# EAGLE design Mux_Board-v0-1-0 (EAGLE 5.06)
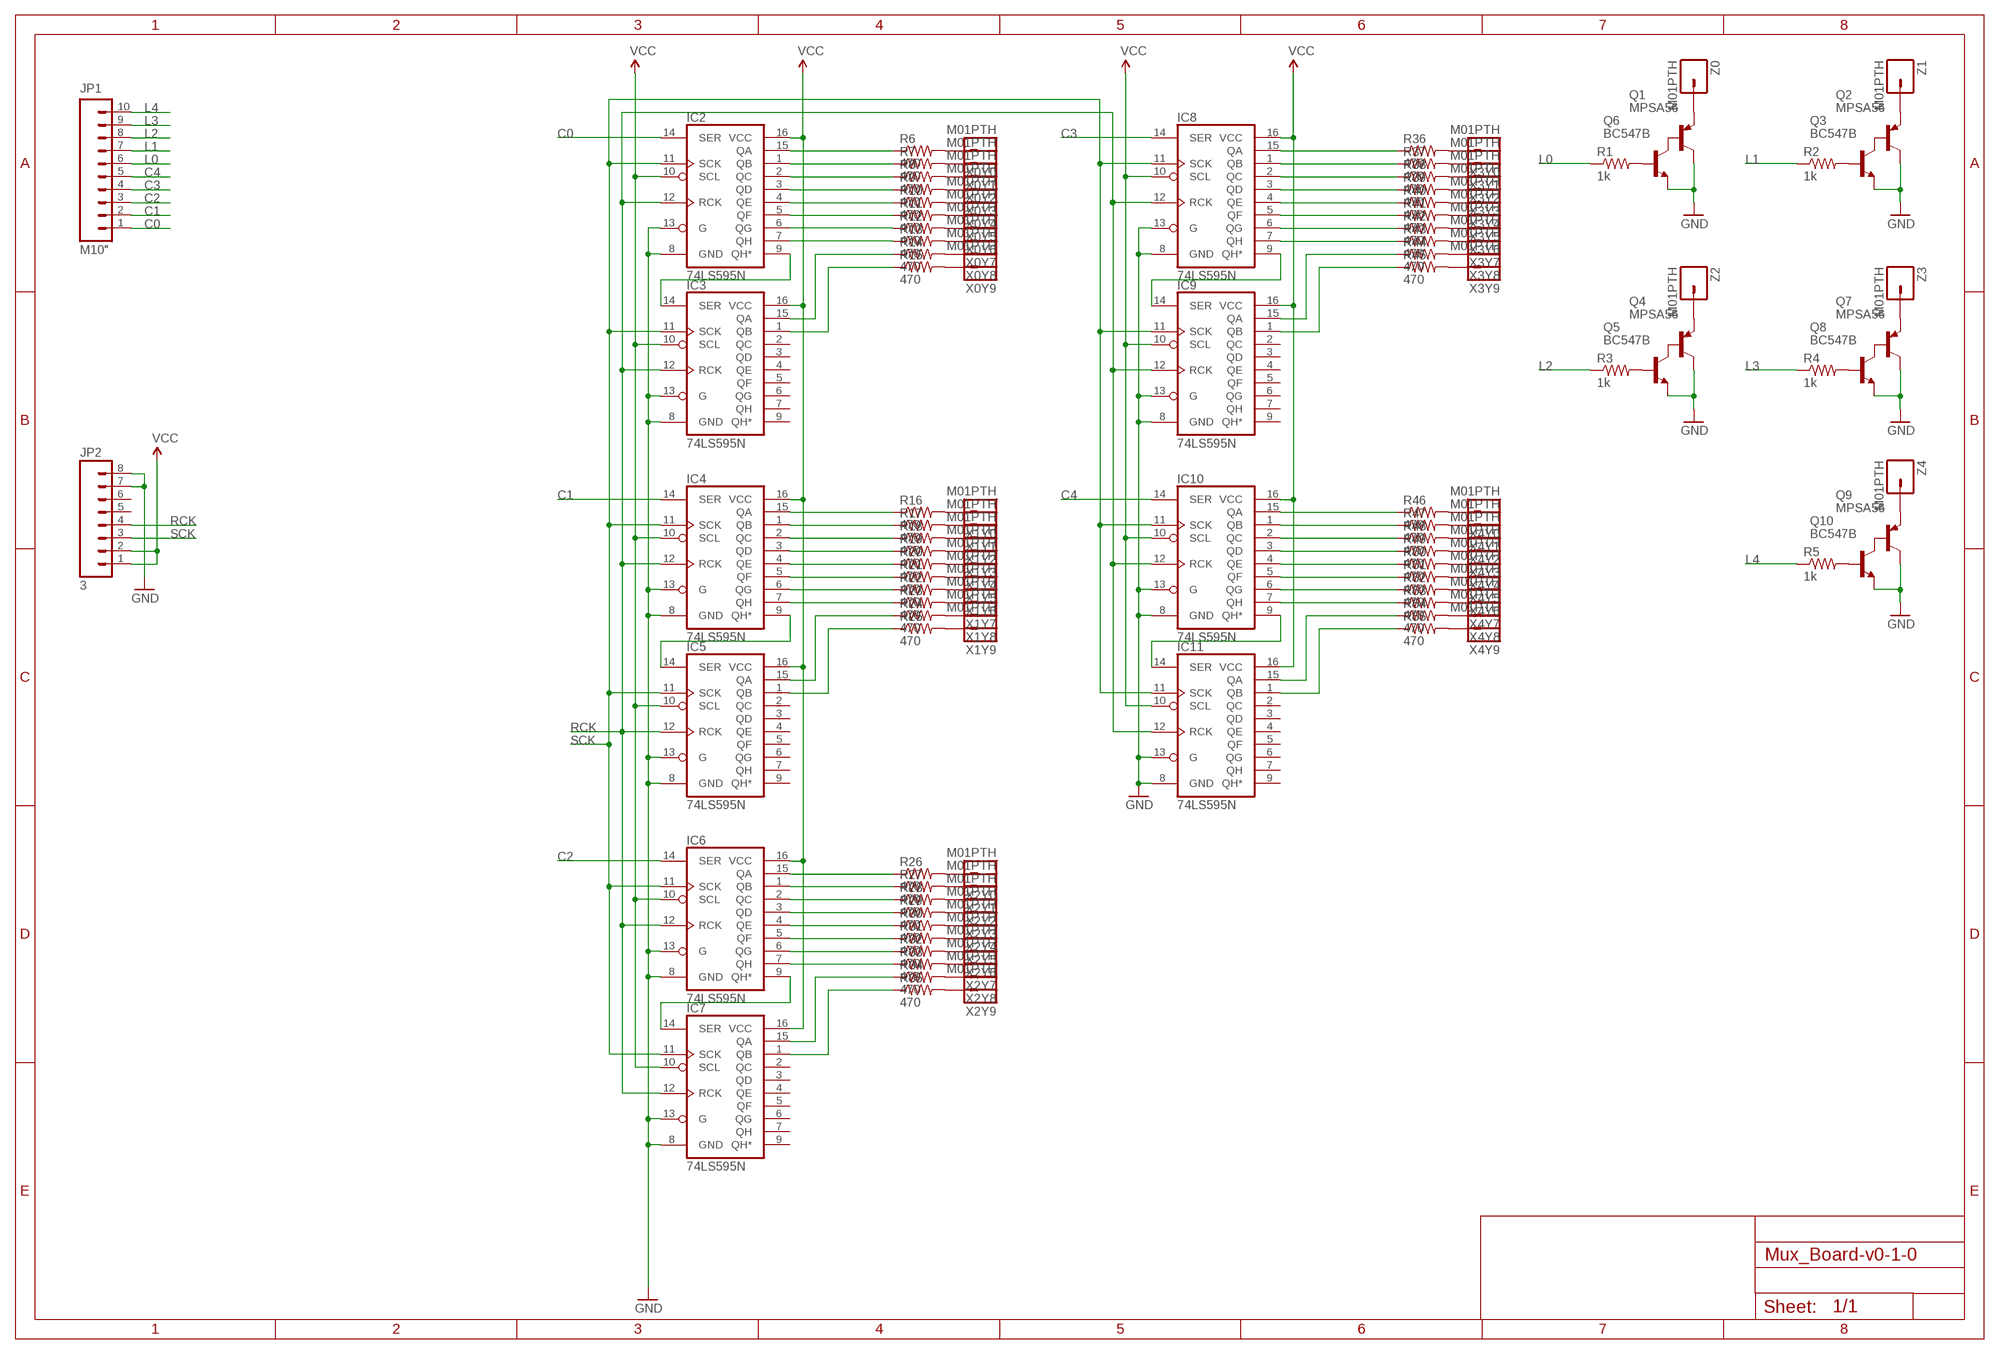
[diagram p0: schematic, sheet 1]

## Parts
IC2  74LS595N  [DIL16]
IC3  74LS595N  [DIL16]
IC4  74LS595N  [DIL16]
IC5  74LS595N  [DIL16]
IC6  74LS595N  [DIL16]
IC7  74LS595N  [DIL16]
IC8  74LS595N  [DIL16]
IC9  74LS595N  [DIL16]
IC10  74LS595N  [DIL16]
IC11  74LS595N  [DIL16]
JP1  M10"  [1X10]
JP2  3  M08  [1X08]
Q1  MPSA56  [TO92-CBE]
Q2  MPSA56  [TO92-CBE]
Q3  BC547B  [TO92]
Q4  MPSA56  [TO92-CBE]
Q5  BC547B  [TO92]
Q6  BC547B  [TO92]
Q7  MPSA56  [TO92-CBE]
Q8  BC547B  [TO92]
Q9  MPSA56  [TO92-CBE]
Q10  BC547B  [TO92]
R1  1k  RESISTORPTH-1/4W  [AXIAL-0.4]
R2  1k  RESISTORPTH-1/4W  [AXIAL-0.4]
R3  1k  RESISTORPTH-1/4W  [AXIAL-0.4]
R4  1k  RESISTORPTH-1/4W  [AXIAL-0.4]
R5  1k  RESISTORPTH-1/4W  [AXIAL-0.4]
R6  470  RESISTORPTH-1/4W  [AXIAL-0.4]
R7  470  RESISTORPTH-1/4W  [AXIAL-0.4]
R8  470  RESISTORPTH-1/4W  [AXIAL-0.4]
R9  470  RESISTORPTH-1/4W  [AXIAL-0.4]
R10  470  RESISTORPTH-1/4W  [AXIAL-0.4]
R11  470  RESISTORPTH-1/4W  [AXIAL-0.4]
R12  470  RESISTORPTH-1/4W  [AXIAL-0.4]
R13  470  RESISTORPTH-1/4W  [AXIAL-0.4]
R14  470  RESISTORPTH-1/4W  [AXIAL-0.4]
R15  470  RESISTORPTH-1/4W  [AXIAL-0.4]
R16  470  RESISTORPTH-1/4W  [AXIAL-0.4]
R17  470  RESISTORPTH-1/4W  [AXIAL-0.4]
R18  470  RESISTORPTH-1/4W  [AXIAL-0.4]
R19  470  RESISTORPTH-1/4W  [AXIAL-0.4]
R20  470  RESISTORPTH-1/4W  [AXIAL-0.4]
R21  470  RESISTORPTH-1/4W  [AXIAL-0.4]
R22  470  RESISTORPTH-1/4W  [AXIAL-0.4]
R23  470  RESISTORPTH-1/4W  [AXIAL-0.4]
R24  470  RESISTORPTH-1/4W  [AXIAL-0.4]
R25  470  RESISTORPTH-1/4W  [AXIAL-0.4]
R26  470  RESISTORPTH-1/4W  [AXIAL-0.4]
R27  470  RESISTORPTH-1/4W  [AXIAL-0.4]
R28  470  RESISTORPTH-1/4W  [AXIAL-0.4]
R29  470  RESISTORPTH-1/4W  [AXIAL-0.4]
R30  470  RESISTORPTH-1/4W  [AXIAL-0.4]
R31  470  RESISTORPTH-1/4W  [AXIAL-0.4]
R32  470  RESISTORPTH-1/4W  [AXIAL-0.4]
R33  470  RESISTORPTH-1/4W  [AXIAL-0.4]
R34  470  RESISTORPTH-1/4W  [AXIAL-0.4]
R35  470  RESISTORPTH-1/4W  [AXIAL-0.4]
R36  470  RESISTORPTH-1/4W  [AXIAL-0.4]
R37  470  RESISTORPTH-1/4W  [AXIAL-0.4]
R38  470  RESISTORPTH-1/4W  [AXIAL-0.4]
R39  470  RESISTORPTH-1/4W  [AXIAL-0.4]
R40  470  RESISTORPTH-1/4W  [AXIAL-0.4]
R41  470  RESISTORPTH-1/4W  [AXIAL-0.4]
R42  470  RESISTORPTH-1/4W  [AXIAL-0.4]
R43  470  RESISTORPTH-1/4W  [AXIAL-0.4]
R44  470  RESISTORPTH-1/4W  [AXIAL-0.4]
R45  470  RESISTORPTH-1/4W  [AXIAL-0.4]
R46  470  RESISTORPTH-1/4W  [AXIAL-0.4]
R47  470  RESISTORPTH-1/4W  [AXIAL-0.4]
R48  470  RESISTORPTH-1/4W  [AXIAL-0.4]
R49  470  RESISTORPTH-1/4W  [AXIAL-0.4]
R50  470  RESISTORPTH-1/4W  [AXIAL-0.4]
R51  470  RESISTORPTH-1/4W  [AXIAL-0.4]
R52  470  RESISTORPTH-1/4W  [AXIAL-0.4]
R53  470  RESISTORPTH-1/4W  [AXIAL-0.4]
R54  470  RESISTORPTH-1/4W  [AXIAL-0.4]
R55  470  RESISTORPTH-1/4W  [AXIAL-0.4]
X0Y0  M01PTH  [1X01]
X0Y1  M01PTH  [1X01]
X0Y2  M01PTH  [1X01]
X0Y3  M01PTH  [1X01]
X0Y4  M01PTH  [1X01]
X0Y5  M01PTH  [1X01]
X0Y6  M01PTH  [1X01]
X0Y7  M01PTH  [1X01]
X0Y8  M01PTH  [1X01]
X0Y9  M01PTH  [1X01]
X1Y0  M01PTH  [1X01]
X1Y1  M01PTH  [1X01]
X1Y2  M01PTH  [1X01]
X1Y3  M01PTH  [1X01]
X1Y4  M01PTH  [1X01]
X1Y5  M01PTH  [1X01]
X1Y6  M01PTH  [1X01]
X1Y7  M01PTH  [1X01]
X1Y8  M01PTH  [1X01]
X1Y9  M01PTH  [1X01]
X2Y0  M01PTH  [1X01]
X2Y1  M01PTH  [1X01]
X2Y2  M01PTH  [1X01]
X2Y3  M01PTH  [1X01]
X2Y4  M01PTH  [1X01]
X2Y5  M01PTH  [1X01]
X2Y6  M01PTH  [1X01]
X2Y7  M01PTH  [1X01]
X2Y8  M01PTH  [1X01]
X2Y9  M01PTH  [1X01]
X3Y0  M01PTH  [1X01]
X3Y1  M01PTH  [1X01]
X3Y2  M01PTH  [1X01]
X3Y3  M01PTH  [1X01]
X3Y4  M01PTH  [1X01]
X3Y5  M01PTH  [1X01]
X3Y6  M01PTH  [1X01]
X3Y7  M01PTH  [1X01]
X3Y8  M01PTH  [1X01]
X3Y9  M01PTH  [1X01]
X4Y0  M01PTH  [1X01]
X4Y1  M01PTH  [1X01]
X4Y2  M01PTH  [1X01]
X4Y3  M01PTH  [1X01]
X4Y4  M01PTH  [1X01]
X4Y5  M01PTH  [1X01]
X4Y6  M01PTH  [1X01]
X4Y7  M01PTH  [1X01]
X4Y8  M01PTH  [1X01]
X4Y9  M01PTH  [1X01]
Z0  M01PTH  [1X01]
Z1  M01PTH  [1X01]
Z2  M01PTH  [1X01]
Z3  M01PTH  [1X01]
Z4  M01PTH  [1X01]

## Nets
C0: IC2.14(SER) JP1.1
C1: IC4.14(SER) JP1.2
C2: IC6.14(SER) JP1.3
C3: IC8.14(SER) JP1.4
C4: IC10.14(SER) JP1.5
GND: IC2.8(GND) IC2.13(G) IC3.8(GND) IC3.13(G) IC4.8(GND) IC4.13(G) IC5.8(GND) IC5.13(G) IC6.8(GND) IC6.13(G) IC7.8(GND) IC7.13(G) IC8.8(GND) IC8.13(G) IC9.8(GND) IC9.13(G) IC10.8(GND) IC10.13(G) IC11.8(GND) IC11.13(G) JP2.7 JP2.8 Q1.C Q2.C Q3.1(E) Q4.C Q5.1(E) Q6.1(E) Q7.C Q8.1(E) Q9.C Q10.1(E)
L0: JP1.6 R1.P$1
L1: JP1.7 R2.P$1
L2: JP1.8 R3.P$1
L3: JP1.9 R4.P$1
L4: JP1.10 R5.P$1
N$2: Q1.E Z0.1
N$3: Q1.B Q6.3(C)
N$4: IC2.7(QH) R13.P$1
N$5: Q6.2(B) R1.P$2
N$8: R6.P$2 X0Y0.1
N$9: R7.P$2 X0Y1.1
N$10: R8.P$2 X0Y2.1
N$11: R9.P$2 X0Y3.1
N$12: R10.P$2 X0Y4.1
N$13: IC2.5(QF) R11.P$1
N$14: IC2.6(QG) R12.P$1
N$15: Q2.E Z1.1
N$16: IC3.15(QA) R14.P$1
N$17: IC3.1(QB) R15.P$1
N$18: Q2.B Q3.3(C)
N$19: R11.P$2 X0Y5.1
N$20: R12.P$2 X0Y6.1
N$21: R13.P$2 X0Y7.1
N$22: R14.P$2 X0Y8.1
N$23: R15.P$2 X0Y9.1
N$24: R16.P$2 X1Y0.1
N$25: R17.P$2 X1Y1.1
N$26: R18.P$2 X1Y2.1
N$28: IC5.15(QA) R24.P$1
N$29: IC5.1(QB) R25.P$1
N$30: Q3.2(B) R2.P$2
N$31: IC7.15(QA) R34.P$1
N$32: R19.P$2 X1Y3.1
N$33: R20.P$2 X1Y4.1
N$34: R21.P$2 X1Y5.1
N$35: R22.P$2 X1Y6.1
N$36: R23.P$2 X1Y7.1
N$37: R24.P$2 X1Y8.1
N$38: R25.P$2 X1Y9.1
N$39: R26.P$2 X2Y0.1
N$40: IC7.1(QB) R35.P$1
N$42: Q4.E Z2.1
N$43: Q4.B Q5.3(C)
N$45: R27.P$2 X2Y1.1
N$46: R28.P$2 X2Y2.1
N$47: R29.P$2 X2Y3.1
N$48: R30.P$2 X2Y4.1
N$49: R31.P$2 X2Y5.1
N$50: R32.P$2 X2Y6.1
N$51: R33.P$2 X2Y7.1
N$52: R34.P$2 X2Y8.1
N$53: IC9.15(QA) R44.P$1
N$54: IC9.1(QB) R45.P$1
N$55: Q5.2(B) R3.P$2
N$56: R35.P$2 X2Y9.1
N$57: R36.P$2 X3Y0.1
N$58: R37.P$2 X3Y1.1
N$59: R38.P$2 X3Y2.1
N$60: R39.P$2 X3Y3.1
N$61: R40.P$2 X3Y4.1
N$62: R41.P$2 X3Y5.1
N$63: R42.P$2 X3Y6.1
N$65: IC11.15(QA) R54.P$1
N$66: IC11.1(QB) R55.P$1
N$67: Q7.E Z3.1
N$68: Q7.B Q8.3(C)
N$69: Q8.2(B) R4.P$2
N$70: Q9.E Z4.1
N$71: Q9.B Q10.3(C)
N$72: Q10.2(B) R5.P$2
N$73: R43.P$2 X3Y7.1
N$74: R44.P$2 X3Y8.1
N$75: R45.P$2 X3Y9.1
N$76: R46.P$2 X4Y0.1
N$77: R47.P$2 X4Y1.1
N$78: R48.P$2 X4Y2.1
N$79: R50.P$2 X4Y4.1
N$80: R49.P$2 X4Y3.1
N$81: R51.P$2 X4Y5.1
N$82: R52.P$2 X4Y6.1
N$83: R53.P$2 X4Y7.1
N$84: R54.P$2 X4Y8.1
N$85: R55.P$2 X4Y9.1
N$86: IC2.15(QA) R6.P$1
N$87: IC2.1(QB) R7.P$1
N$88: IC2.2(QC) R8.P$1
N$89: IC2.3(QD) R9.P$1
N$90: IC2.4(QE) R10.P$1
N$91: IC4.15(QA) R16.P$1
N$92: IC4.1(QB) R17.P$1
N$93: IC4.2(QC) R18.P$1
N$94: IC4.3(QD) R19.P$1
N$95: IC4.4(QE) R20.P$1
N$96: IC4.5(QF) R21.P$1
N$97: IC4.6(QG) R22.P$1
N$98: IC4.7(QH) R23.P$1
N$99: IC6.15(QA) R26.P$1
N$100: IC6.1(QB) R27.P$1
N$101: IC6.2(QC) R28.P$1
N$102: IC6.3(QD) R29.P$1
N$103: IC6.4(QE) R30.P$1
N$104: IC6.5(QF) R31.P$1
N$105: IC6.6(QG) R32.P$1
N$106: IC6.7(QH) R33.P$1
N$107: IC8.15(QA) R36.P$1
N$108: IC8.1(QB) R37.P$1
N$109: IC8.2(QC) R38.P$1
N$110: IC8.3(QD) R39.P$1
N$111: IC8.4(QE) R40.P$1
N$112: IC8.5(QF) R41.P$1
N$113: IC8.6(QG) R42.P$1
N$114: IC8.7(QH) R43.P$1
N$115: IC10.15(QA) R46.P$1
N$116: IC10.1(QB) R47.P$1
N$117: IC10.2(QC) R48.P$1
N$118: IC10.3(QD) R49.P$1
N$119: IC10.4(QE) R50.P$1
N$120: IC10.5(QF) R51.P$1
N$121: IC10.6(QG) R52.P$1
N$122: IC10.7(QH) R53.P$1
QH0: IC2.9(QH*) IC3.14(SER)
QH1: IC4.9(QH*) IC5.14(SER)
QH2: IC6.9(QH*) IC7.14(SER)
QH3: IC8.9(QH*) IC9.14(SER)
QH4: IC10.9(QH*) IC11.14(SER)
RCK: IC2.12(RCK) IC3.12(RCK) IC4.12(RCK) IC5.12(RCK) IC6.12(RCK) IC7.12(RCK) IC8.12(RCK) IC9.12(RCK) IC10.12(RCK) IC11.12(RCK) JP2.4
SCK: IC2.11(SCK) IC3.11(SCK) IC4.11(SCK) IC5.11(SCK) IC6.11(SCK) IC7.11(SCK) IC8.11(SCK) IC9.11(SCK) IC10.11(SCK) IC11.11(SCK) JP2.3
VCC: IC2.10(SCL) IC2.16(VCC) IC3.10(SCL) IC3.16(VCC) IC4.10(SCL) IC4.16(VCC) IC5.10(SCL) IC5.16(VCC) IC6.10(SCL) IC6.16(VCC) IC7.10(SCL) IC7.16(VCC) IC8.10(SCL) IC8.16(VCC) IC9.10(SCL) IC9.16(VCC) IC10.10(SCL) IC10.16(VCC) IC11.10(SCL) IC11.16(VCC) JP2.1 JP2.2
Unconnected: IC3.2(QC) IC3.3(QD) IC3.4(QE) IC3.5(QF) IC3.6(QG) IC3.7(QH) IC3.9(QH*) IC5.2(QC) IC5.3(QD) IC5.4(QE) IC5.5(QF) IC5.6(QG) IC5.7(QH) IC5.9(QH*) IC7.2(QC) IC7.3(QD) IC7.4(QE) IC7.5(QF) IC7.6(QG) IC7.7(QH) IC7.9(QH*) IC9.2(QC) IC9.3(QD) IC9.4(QE) IC9.5(QF) IC9.6(QG) IC9.7(QH) IC9.9(QH*) IC11.2(QC) IC11.3(QD) IC11.4(QE) IC11.5(QF) IC11.6(QG) IC11.7(QH) IC11.9(QH*) JP2.5 JP2.6

## Library data of the parts
IC2-IC11 = SparkFun:74*595: 8-bit SHIFT REGISTER, output latch
JP1 = SparkFun:M10: Header 10 Standard 10-pin 0.1" header. Use with straight break away headers (SKU : PRT-00116), right angle break away headers (PRT-00553), swiss pins (PRT-00743), machine pins (PRT-00117), and female headers (PRT-00115).
JP2 = SparkFun:M08: Header 8 Standard 8-pin 0.1" header. Use with straight break away headers (SKU : PRT-00116), right angle break away headers (PRT-00553), swiss pins (PRT-00743), machine pins (PRT-00117), and female headers (PRT-00115).
Q1 Q2 Q4 Q7 Q9 = transistor-pnp:MPSA56*: PNP Transistror Source: http://www.fairchildsemi.com/ds/MM/MMBTA56.pdf
Q3 Q5 Q6 Q8 Q10 = transistor-npn:BC547*: NPN Transistor
R1-R55 = SparkFun:RESISTOR: Resistor Basic schematic elements and footprints for 0603, 1206, and PTH resistors.
X0Y0 X0Y1-X0Y9 X1Y0 X1Y1-X1Y9 X2Y0 X2Y1-X2Y9 X3Y0 X3Y1-X3Y9 X4Y0 X4Y1-X4Y9 Z0 Z1-Z4 = SparkFun:M01: Header 1 Standard 1-pin 0.1" header. Use with straight break away headers (SKU : PRT-00116), right angle break away headers (PRT-00553), swiss pins (PRT-00743), machine pins (PRT-00117), and female headers (PRT-00115).

## Board
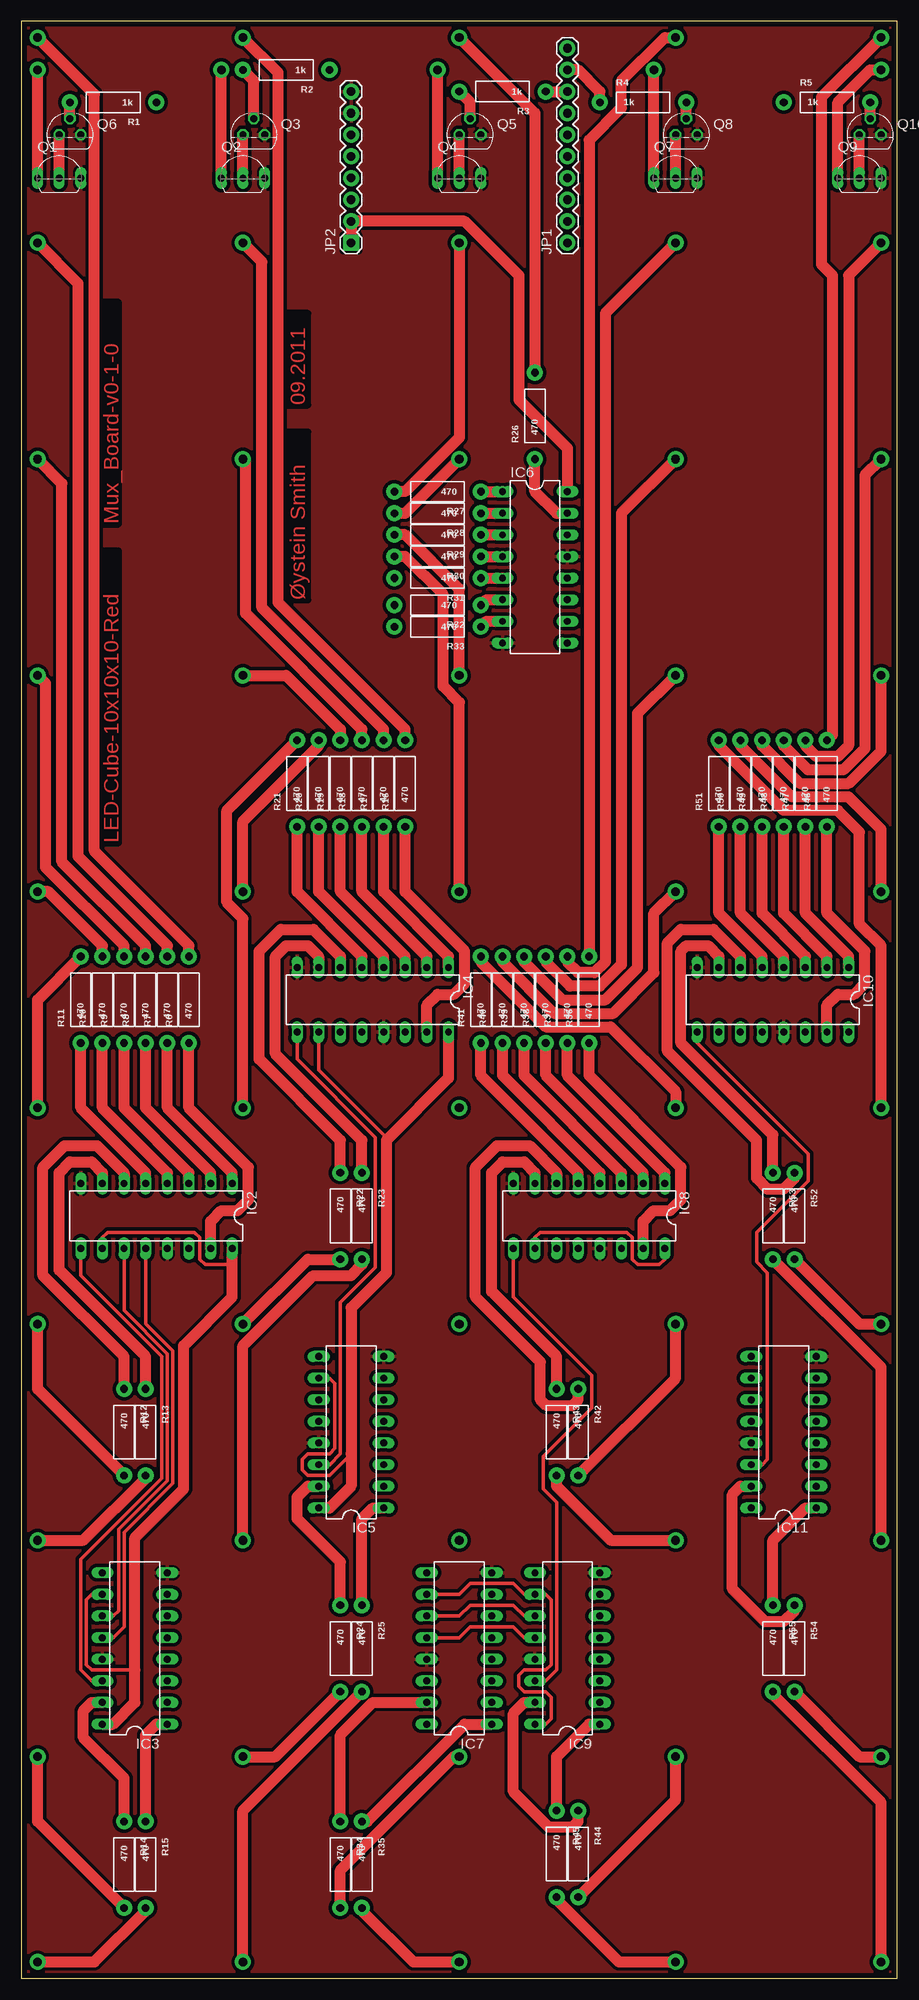
[diagram p1: board, top side]
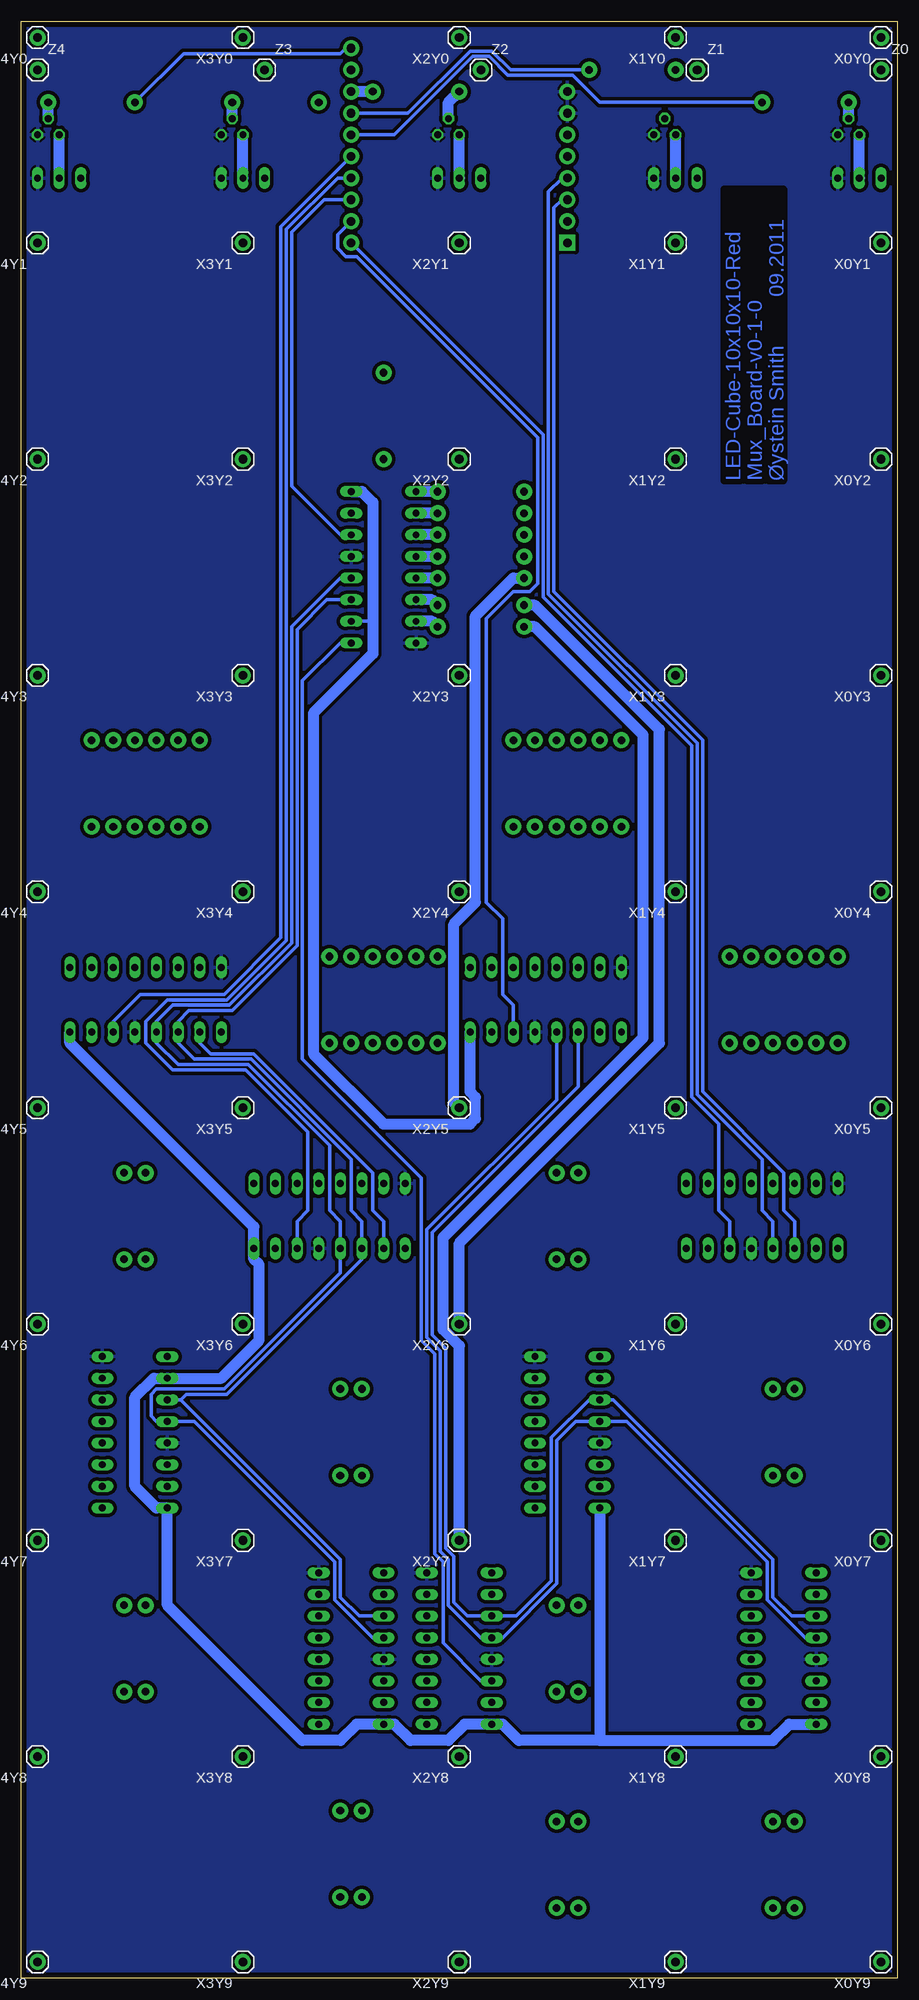
[diagram p2: board, bottom side, seen from below]

Size 102.87 x 229.87 mm. Coordinates in mm from the lower left corner, seen from the top.
Outline: 0,0 102.87,0 102.87,229.87 0,229.87 0,0
Copper layers (1*16): Top 0.035mm / dielectric 1.5mm / Bottom 0.035mm
Design rules "default *": minimum track width 10mil, minimum drill 24mil, track to track 8mil, track to pad 8mil, pad to pad 8mil, via to via 8mil, smd to smd 8mil, copper to edge 25mil, drill to drill 8mil, minimum pad ring 10mil, minimum via ring 8mil, stop-mask expansion 4mil, vias tented up to drill 0mil, thermal gap 10mil
tRestrict: area 9.5,133.4 to 11.4,167.6; area 9.5,170.8 to 11.4,196.8; area 31.1,161.9 to 33.7,181.6; area 31.1,184.8 to 33.7,195.6
bRestrict: area 13.3,175.9 to 20.3,210.2

### Footprints (pad centres in the part's own frame; a part is rotated, then mirrored left to right if it is on the bottom)
DIL16 = drill 0.813 long: 1 -8.89,-3.81; 2 -6.35,-3.81; 3 -3.81,-3.81; 4 -1.27,-3.81; 5 1.27,-3.81; 6 3.81,-3.81; 7 6.35,-3.81; 8 8.89,-3.81; 9 8.89,3.81; 10 6.35,3.81; 11 3.81,3.81; 12 1.27,3.81; 13 -1.27,3.81; 14 -3.81,3.81; 15 -6.35,3.81; 16 -8.89,3.81
1X10 = drill 1.016 pad 1.88 round: 1 0,0; 2 2.54,0; 3 5.08,0; 4 7.62,0; 5 10.16,0; 6 12.7,0; 7 15.24,0; 8 17.78,0; 9 20.32,0; 10 22.86,0
1X08 = drill 1.016 pad 1.88 square: 1 0,0 | drill 1.016 pad 1.88 round: 2 2.54,0; 3 5.08,0; 4 7.62,0; 5 10.16,0; 6 12.7,0; 7 15.24,0; 8 17.78,0
TO92-CBE = drill 0.813 long: B 0,0; C 2.54,0; E -2.54,0
TO92 = drill 0.813 octagon: 1 1.27,0; 2 0,1.905; 3 -1.27,0
AXIAL-0.4 = drill 0.9 pad 1.88 round: P$1 -5.08,0; P$2 5.08,0
1X01 = drill 1.016 pad 1.88 round: 1 0,0

### Placement (x,y rotation side)
IC2  15.88,89.54 180 top
IC3  13.33,38.73 90 top
IC4  41.27,114.94 180 top
IC5  38.73,64.14 90 top
IC6  60.32,165.73 270 top
IC7  51.43,38.73 90 top
IC8  66.68,89.54 180 top
IC9  64.14,38.73 90 top
IC10  88.27,114.94 180 top
IC11  89.54,64.14 90 top
JP1  64.14,203.83 90 top
JP2  38.73,203.83 90 top
Q1  4.45,211.45 0 top
Q2  26.04,211.45 0 top
Q3  27.31,216.53 0 top
Q4  51.43,211.45 0 top
Q5  52.7,216.53 0 top
Q6  5.71,216.53 0 top
Q7  76.84,211.45 0 top
Q8  78.11,216.53 0 top
Q9  98.43,211.45 0 top
Q10  99.7,216.53 0 top
R1  10.79,220.34 180 top
R2  31.12,224.16 180 top
R3  56.52,221.61 180 top
R4  73.03,220.34 0 top
R5  94.62,220.34 0 top
R6  19.69,114.94 90 top
R7  17.15,114.94 90 top
R8  14.61,114.94 90 top
R9  12.06,114.94 90 top
R10  9.53,114.94 90 top
R11  6.98,114.94 90 top
R12  12.06,64.14 270 top
R13  14.61,64.14 270 top
R14  12.06,13.33 270 top
R15  14.61,13.33 270 top
R16  45.09,140.33 90 top
R17  42.54,140.33 90 top
R18  40,140.33 90 top
R19  37.46,140.33 90 top
R20  34.92,140.33 90 top
R21  32.38,140.33 90 top
R22  37.46,89.54 270 top
R23  40,89.54 270 top
R24  37.46,38.73 270 top
R25  40,38.73 270 top
R26  60.32,183.51 90 top
R27  48.89,174.62 180 top
R28  48.89,172.08 180 top
R29  48.89,169.54 180 top
R30  48.89,167 180 top
R31  48.89,164.47 180 top
R32  48.89,161.29 180 top
R33  48.89,158.75 180 top
R34  37.46,13.33 270 top
R35  40,13.33 270 top
R36  66.68,114.94 90 top
R37  64.14,114.94 90 top
R38  61.59,114.94 90 top
R39  59.05,114.94 90 top
R40  56.52,114.94 90 top
R41  53.98,114.94 90 top
R42  65.41,64.14 270 top
R43  62.86,64.14 270 top
R44  65.41,14.61 270 top
R45  62.86,14.61 270 top
R46  94.62,140.33 90 top
R47  92.08,140.33 90 top
R48  89.54,140.33 90 top
R49  87,140.33 90 top
R50  84.45,140.33 90 top
R51  81.92,140.33 90 top
R52  90.81,89.54 270 top
R53  88.27,89.54 270 top
R54  90.81,38.73 270 top
R55  88.27,38.73 270 top
X0Y0  1.91,227.97 180 bottom
X0Y1  1.91,203.83 180 bottom
X0Y2  1.91,178.44 180 bottom
X0Y3  1.91,153.03 180 bottom
X0Y4  1.91,127.64 180 bottom
X0Y5  1.91,102.23 180 bottom
X0Y6  1.91,76.84 180 bottom
X0Y7  1.91,51.43 180 bottom
X0Y8  1.91,26.04 180 bottom
X0Y9  1.91,1.91 180 bottom
X1Y0  26.04,227.97 180 bottom
X1Y1  26.04,203.83 180 bottom
X1Y2  26.04,178.44 180 bottom
X1Y3  26.04,153.03 180 bottom
X1Y4  26.04,127.64 180 bottom
X1Y5  26.04,102.23 180 bottom
X1Y6  26.04,76.84 180 bottom
X1Y7  26.04,51.43 180 bottom
X1Y8  26.04,26.04 180 bottom
X1Y9  26.04,1.91 180 bottom
X2Y0  51.43,227.97 180 bottom
X2Y1  51.43,203.83 180 bottom
X2Y2  51.43,178.44 180 bottom
X2Y3  51.43,153.03 180 bottom
X2Y4  51.43,127.64 180 bottom
X2Y5  51.43,102.23 180 bottom
X2Y6  51.43,76.84 180 bottom
X2Y7  51.43,51.43 180 bottom
X2Y8  51.43,26.04 180 bottom
X2Y9  51.43,1.91 180 bottom
X3Y0  76.84,227.97 180 bottom
X3Y1  76.84,203.83 180 bottom
X3Y2  76.84,178.44 180 bottom
X3Y3  76.84,153.03 180 bottom
X3Y4  76.84,127.64 180 bottom
X3Y5  76.84,102.23 180 bottom
X3Y6  76.84,76.84 180 bottom
X3Y7  76.84,51.43 180 bottom
X3Y8  76.84,26.04 180 bottom
X3Y9  76.84,1.91 180 bottom
X4Y0  100.97,227.97 180 bottom
X4Y1  100.97,203.83 180 bottom
X4Y2  100.97,178.44 180 bottom
X4Y3  100.97,153.03 180 bottom
X4Y4  100.97,127.64 180 bottom
X4Y5  100.97,102.23 180 bottom
X4Y6  100.97,76.84 180 bottom
X4Y7  100.97,51.43 180 bottom
X4Y8  100.97,26.04 180 bottom
X4Y9  100.97,1.91 180 bottom
Z0  1.91,224.16 0 bottom
Z1  23.5,224.16 0 bottom
Z2  48.89,224.16 0 bottom
Z3  74.3,224.16 0 bottom
Z4  100.97,224.16 0 bottom

### Tracks (layer width: path | path; a pad name or v marks a point on that pad's centre or on a via)
C0
  Bottom 0.406: IC2.14 19.69,88.9 20.96,90.17 20.96,100.33 24.13,103.51 24.13,144.78 41.59,162.24 41.59,181.29 JP1.1
C1
  Bottom 0.406: IC4.14 45.09,114.3 46.35,115.57 46.35,124.46 48.26,126.37 48.26,159.7 45.09,162.88 43.18,162.88 42.23,163.83 42.23,180.97 63.5,202.25 64.77,202.25 65.72,203.2 65.72,204.79 JP1.2
C2
  Bottom 0.406: IC6.14 65.41,169.54 71.12,175.26 71.12,205.1 67.31,208.91 JP1.3
C3
  Bottom 0.406: IC8.14 70.48,88.9 69.22,90.17 69.22,99.38 76.52,106.68 85.09,106.68 88.27,109.86 88.27,112.4 85.73,114.94 78.74,114.94 71.76,121.92 71.76,205.42 65.72,211.45 JP1.4
C4
  Bottom 0.406: IC10.14 92.08,112.4 88.9,115.57 79.06,115.57 72.39,122.24 72.39,205.74 JP1.5
GND
  pour Bottom (isolate 0.406, rank 2): 0,229.87 102.87,229.87 102.87,0 0,0
  pour Top (isolate 0.406, rank 2): 0,229.87 102.87,229.87 102.87,0 0,0
L0
  Bottom 0.406: R1.P$1 34.92,220.34 38.1,223.52 45.72,223.52 47.94,225.74 49.85,225.74 59.05,216.53 JP1.6
L1
  Bottom 0.406: R2.P$1 45.4,224.16 47.62,226.38 50.16,226.38 57.47,219.07 JP1.7
L2
  Top 1.27: R3.P$1 JP1.8
  Bottom 1.27: R3.P$1 JP1.8
L3
  Top 1.27: R4.P$1 67.95,221.61 65.41,224.16 JP1.9
L4
  Bottom 0.406: R5.P$1 83.82,226.06 65.41,226.06 64.77,226.69 JP1.10
N$2
  Top 1.27: Q1.E Z0.1
N$3
  Top 1.27: Q1.B Q6.3
  Bottom 1.27: Q1.B Q6.3
N$4
  Top 1.27: R13.P$1 14.61,73.03 4.45,83.19 4.45,94.62 5.71,95.89 8.26,95.89 9.53,94.62 IC2.7
N$5
  Top 1.27: Q6.2 R1.P$2
  Bottom 1.27: Q6.2 R1.P$2
N$8
  Top 1.27: R6.P$2 19.69,121.29 8.57,132.4 8.57,221.3 X0Y0.1
N$9
  Top 1.27: X0Y1.1 6.67,199.07 6.67,131.76 17.15,121.29 R7.P$2
N$10
  Top 1.27: X0Y2.1 4.76,175.58 4.76,131.13 14.61,121.29 R8.P$2
N$11
  Top 1.27: R9.P$2 12.06,121.29 2.86,130.49 2.86,152.08 X0Y3.1
N$12
  Top 1.27: X0Y4.1 3.17,127.64 9.53,121.29 R10.P$2
N$13
  Top 1.27: R11.P$1 6.98,102.23 14.61,94.62 IC2.5
N$14
  Top 1.27: R12.P$1 12.06,73.03 2.54,82.55 2.54,95.25 5.08,97.79 8.89,97.79 12.06,94.62 IC2.6
N$15
  Top 1.27: Q2.E Z1.1
N$16
  Top 1.27: IC3.15 8.26,32.38 7.3,31.43 7.3,28.26 12.06,23.5 R14.P$1
N$17
  Top 1.27: R15.P$1 14.61,28.58 15.88,29.85 IC3.1
N$18
  Top 1.27: Q2.B Q3.3
  Bottom 1.27: Q2.B Q3.3
N$19
  Top 1.27: X0Y5.1 1.91,114.94 R11.P$2
N$20
  Top 1.27: X0Y6.1 1.91,69.22 R12.P$2
N$21
  Top 1.27: X0Y7.1 7.3,51.43 14.61,58.74 R13.P$2
N$22
  Top 1.27: X0Y8.1 1.91,18.42 R14.P$2
N$23
  Top 1.27: R15.P$2 14.61,7.94 8.57,1.91 X0Y9.1
N$24
  Top 1.27: R16.P$2 45.09,146.69 30.16,161.61 30.16,223.84 X1Y0.1
N$25
  Top 1.27: X1Y1.1 28.26,201.61 28.26,160.97 42.54,146.69 R17.P$2
N$26
  Top 1.27: R18.P$2 40,146.69 26.35,160.34 26.35,178.12 X1Y2.1
N$28
  Top 1.27: IC5.15 33.66,57.78 32.38,56.52 32.38,53.98 37.46,48.89 R24.P$1
N$29
  Top 1.27: IC5.1 41.27,55.24 40,53.98 R25.P$1
N$30
  Top 1.27: Q3.2 27.31,222.88 R2.P$2
N$31
  Top 1.27: IC7.15 41.27,32.38 37.46,28.58 R34.P$1
N$32
  Top 1.27: R19.P$2 37.46,146.69 31.12,153.03 X1Y3.1
N$33
  Top 1.27: X1Y4.1 26.04,135.89 34.92,144.78 R20.P$2
N$34
  Top 1.27: X1Y5.1 26.04,124.46 24.13,126.37 24.13,137.16 R21.P$2
N$35
  Top 1.27: X1Y6.1 33.66,84.45 R22.P$2
N$36
  Top 1.27: X1Y7.1 26.04,74.3 34.29,82.55 38.73,82.55 40,83.82 R23.P$2
N$37
  Top 1.27: X1Y8.1 29.85,26.04 R24.P$2
N$38
  Top 1.27: X1Y9.1 26.04,19.69 R25.P$2
N$39
  Top 1.27: R26.P$2 60.32,219.07 X2Y0.1
N$40
  Top 1.27: R35.P$1 40.64,18.42 52.07,29.85 IC7.1
N$42
  Top 1.27: Q4.E Z2.1
N$43
  Top 1.27: Q4.B Q5.3
  Bottom 1.27: Q4.B Q5.3
N$45
  Top 1.27: R27.P$2 45.09,174.62 51.43,180.97 X2Y1.1
N$46
  Top 1.27: X2Y2.1 45.09,172.08 R28.P$2
N$47
  Top 1.27: X2Y3.1 51.43,163.19 45.09,169.54 R29.P$2
N$48
  Top 1.27: X2Y4.1 51.43,149.86 49.53,151.76 49.53,162.56 45.09,167 R30.P$2
N$49
  Bottom 1.27: X2Y5.1 52.07,102.87 52.07,123.83 49.53,126.37 49.53,160.02 45.09,164.47 R31.P$2
N$50
  Bottom 1.27: R32.P$2 42.54,161.29 27.94,146.69 27.94,109.86 51.43,86.36 X2Y6.1
N$51
  Bottom 1.27: X2Y7.1 51.43,74.3 53.34,76.2 53.34,87 29.85,110.49 29.85,146.05 42.54,158.75 R33.P$2
N$52
  Top 1.27: R34.P$2 37.46,12.7 50.8,26.04 X2Y8.1
N$53
  Top 1.27: R44.P$1 65.41,18.42 64.77,17.78 61.91,17.78 57.78,21.91 57.78,31.12 59.05,32.38 IC9.15
N$54
  Top 1.27: IC9.1 66.68,29.85 62.86,26.04 R45.P$1
N$55
  Top 1.27: Q5.2 52.7,220.34 R3.P$2
  Bottom 1.27: R3.P$2 52.7,220.34 Q5.2
N$56
  Top 1.27: X2Y9.1 46.04,1.91 40,7.94 R35.P$2
N$57
  Top 1.27: X3Y0.1 75.57,227.97 70.48,222.88 70.48,219.71 66.68,215.9 R36.P$2
N$58
  Top 1.27: X3Y1.1 68.58,195.58 68.58,119.38 67.31,118.11 65.41,118.11 64.14,119.38 R37.P$2
N$59
  Top 1.27: X3Y2.1 70.48,172.08 70.48,119.06 67.95,116.52 64.45,116.52 61.59,119.38 R38.P$2
N$60
  Top 1.27: X3Y3.1 72.39,148.59 72.39,118.75 68.58,114.94 63.5,114.94 59.05,119.38 R39.P$2
N$61
  Top 1.27: X3Y4.1 74.3,125.09 74.3,118.11 69.53,113.35 62.55,113.35 56.52,119.38 R40.P$2
N$62
  Top 1.27: X3Y5.1 76.84,104.14 69.22,111.76 61.59,111.76 53.98,119.38 R41.P$2
N$63
  Top 1.27: X3Y6.1 76.84,70.48 R42.P$2
N$65
  Top 1.27: R54.P$1 90.81,43.18 89.54,41.91 87.31,41.91 83.5,45.72 83.5,56.83 84.45,57.78 IC11.15
N$66
  Top 1.27: R55.P$1 88.27,51.43 92.08,55.24 IC11.1
N$67
  Top 1.27: Q7.E Z3.1
N$68
  Top 1.27: Q7.B Q8.3
  Bottom 1.27: Q7.B Q8.3
N$69
  Top 1.27: Q8.2 R4.P$2
  Bottom 1.27: Q8.2 R4.P$2
N$70
  Top 1.27: Z4.1 99.7,224.16 95.89,220.34 Q9.E
N$71
  Top 1.27: Q10.3 Q9.B 98.43,210.82
  Bottom 1.27: Q9.B Q10.3
N$72
  Top 1.27: Q10.2 R5.P$2
  Bottom 1.27: Q10.2 R5.P$2
N$73
  Top 1.27: X3Y7.1 69.22,51.43 62.86,57.78 R43.P$2
N$74
  Top 1.27: R44.P$2 76.84,20.96 X3Y8.1
N$75
  Top 1.27: X3Y9.1 70.17,1.91 62.86,9.21 R45.P$2
N$76
  Top 1.27: R46.P$2 95.25,146.05 95.25,200.02 93.98,201.29 93.98,220.98 X4Y0.1
N$77
  Top 1.27: X4Y1.1 97.16,200.02 97.16,144.78 95.89,143.51 93.34,143.51 92.08,144.78 R47.P$2
N$78
  Top 1.27: X4Y2.1 99.06,176.53 99.06,144.46 96.52,141.92 92.39,141.92 89.54,144.78 R48.P$2
N$79
  Top 1.27: X4Y4.1 100.97,134.94 97.16,138.75 90.49,138.75 84.45,144.78 R50.P$2
N$80
  Top 1.27: X4Y3.1 100.97,144.14 97.16,140.33 91.44,140.33 87,144.78 R49.P$2
N$81
  Top 1.27: R51.P$2 81.92,144.78 89.54,137.16 95.89,137.16 98.43,134.62 98.43,123.83 100.97,121.29 X4Y5.1
N$82
  Top 1.27: X4Y6.1 98.43,76.84 R52.P$2
N$83
  Top 1.27: R53.P$2 100.97,71.76 X4Y7.1
N$84
  Top 1.27: X4Y8.1 98.43,26.04 R54.P$2
N$85
  Top 1.27: X4Y9.1 100.97,20.64 88.27,33.34 R55.P$2
N$86
  Top 1.27: R6.P$1 19.69,102.23 26.67,95.25 26.67,91.44 25.4,90.17 23.5,90.17 22.23,88.9 IC2.15
N$87
  Top 1.27: R7.P$1 17.15,102.23 24.77,94.62 IC2.1
N$88
  Top 1.27: R8.P$1 14.61,102.23 22.23,94.62 IC2.2
N$89
  Top 1.27: R9.P$1 12.06,102.23 19.69,94.62 IC2.3
N$90
  Top 1.27: R10.P$1 9.53,102.23 17.15,94.62 IC2.4
N$91
  Top 1.27: R16.P$1 45.09,127.64 52.07,120.65 52.07,116.84 50.8,115.57 48.89,115.57 47.62,114.3 IC4.15
N$92
  Top 1.27: IC4.1 50.16,120.02 42.54,127.64 R17.P$1
N$93
  Top 1.27: IC4.2 47.62,120.02 40,127.64 R18.P$1
N$94
  Top 1.27: IC4.3 45.09,120.02 37.46,127.64 R19.P$1
N$95
  Top 1.27: IC4.4 42.54,120.02 34.92,127.64 R20.P$1
N$96
  Top 1.27: IC4.5 40,120.02 32.38,127.64 R21.P$1
N$97
  Top 1.27: R22.P$1 37.46,98.43 27.94,107.95 27.94,120.65 30.48,123.19 34.29,123.19 37.46,120.02 IC4.6
N$98
  Top 1.27: R23.P$1 40,98.43 29.85,108.59 29.85,120.02 31.12,121.29 33.66,121.29 34.92,120.02 IC4.7
N$99
  Top 1.27: R26.P$1 60.32,174.62 62.86,172.08 IC6.15
N$100
  Top 1.27: R27.P$1 IC6.1
  Bottom 1.27: R27.P$1 IC6.1
N$101
  Top 1.27: R28.P$1 IC6.2
  Bottom 1.27: R28.P$1 IC6.2
N$102
  Top 1.27: R29.P$1 IC6.3
  Bottom 1.27: R29.P$1 IC6.3
N$103
  Top 1.27: R30.P$1 IC6.4
  Bottom 1.27: R30.P$1 IC6.4
N$104
  Top 1.27: R31.P$1 IC6.5
  Bottom 1.27: R31.P$1 IC6.5
N$105
  Top 1.27: IC6.6 54.61,161.92 R32.P$1
  Bottom 1.27: IC6.6 54.61,161.92 R32.P$1
N$106
  Top 1.27: IC6.7 54.61,159.38 R33.P$1
  Bottom 1.27: IC6.7 54.61,159.38 R33.P$1
N$107
  Top 1.27: IC8.15 73.03,88.9 74.3,90.17 76.2,90.17 77.47,91.44 77.47,95.25 66.68,106.05 R36.P$1
N$108
  Top 1.27: IC8.1 75.57,94.62 64.14,106.05 R37.P$1
N$109
  Top 1.27: IC8.2 73.03,94.62 61.59,106.05 R38.P$1
N$110
  Top 1.27: IC8.3 70.48,94.62 59.05,106.05 R39.P$1
N$111
  Top 1.27: IC8.4 67.95,94.62 56.52,106.05 R40.P$1
N$112
  Top 1.27: IC8.5 65.41,94.62 53.98,106.05 R41.P$1
N$113
  Top 1.27: R42.P$1 65.41,67.95 64.77,67.31 61.59,67.31 60.96,67.95 60.96,72.39 53.34,80.01 53.34,95.25 55.88,97.79 59.69,97.79 62.86,94.62 IC8.6
N$114
  Top 1.27: R43.P$1 62.86,73.03 55.24,80.65 55.24,94.62 56.52,95.89 59.05,95.89 60.32,94.62 IC8.7
N$115
  Top 1.27: IC10.15 94.62,114.3 95.89,115.57 97.79,115.57 99.06,116.84 99.06,120.65 94.62,125.09 R46.P$1
N$116
  Top 1.27: IC10.1 97.16,120.02 92.08,125.09 R47.P$1
N$117
  Top 1.27: IC10.2 94.62,120.02 89.54,125.09 R48.P$1
N$118
  Top 1.27: IC10.3 92.08,120.02 87,125.09 R49.P$1
N$119
  Top 1.27: IC10.4 89.54,120.02 84.45,125.09 R50.P$1
N$120
  Top 1.27: IC10.5 87,120.02 81.92,125.09 R51.P$1
N$121
  Top 1.27: R52.P$1 90.81,93.98 89.54,92.71 87.63,92.71 86.36,93.98 86.36,98.43 75.88,108.9 75.88,121.6 77.47,123.19 81.28,123.19 84.45,120.02 IC10.6
N$122
  Top 1.27: IC10.7 81.92,120.02 80.65,121.29 78.11,121.29 77.47,120.65 77.47,109.86 88.27,99.06 R53.P$1
QH0
  Top 0.406: IC2.9 6.98,82.55 16.51,73.03 16.51,58.74 6.98,49.21 6.98,36.2 8.26,34.92 IC3.14
QH1
  Top 0.406: IC4.9 32.38,107.95 41.59,98.74 41.59,83.5 37.46,79.38 37.46,61.59 36.2,60.32 IC5.14
QH2
  Bottom 0.406: IC6.9 65.41,156.84 69.85,152.4 69.85,107.95 55.88,93.98 55.88,74.93 54.29,73.34 54.29,49.85 53.34,48.89 53.34,39.37 48.89,34.92 IC7.14
QH3
  Top 0.406: IC8.9 57.78,80.01 66.99,70.8 66.99,66.99 61.28,61.28 61.28,57.47 62.86,55.88 62.86,36.2 61.59,34.92 IC9.14
QH4
  Top 0.406: IC10.9 79.38,109.86 92.39,96.84 92.39,93.66 86.36,87.63 86.36,84.14 87.63,82.87 87.63,60.96 87,60.32 IC11.14
RCK
  Top 0.406: IC7.12 51.43,40 52.7,41.27 57.78,41.27 59.05,40 IC9.12 | IC3.12 10.79,40 12.06,41.27 12.06,52.39 17.78,58.1 17.78,73.66 14.61,76.84 IC2.12
  Bottom 0.406: IC3.12 10.79,40 15.24,44.45 15.24,48.89 31.75,65.41 IC5.12 37.78,65.41 40,63.18 40,46.35 46.35,40 IC7.12 48.89,40 52.7,43.81 52.7,49.21 53.66,50.16 53.66,73.66 55.24,75.25 55.24,87.95 40,103.19 IC4.12 | 82.55,65.41 IC11.12 | 82.55,65.41 66.04,48.89 66.04,44.45 61.59,40 IC9.12 | 82.55,65.41 87,65.41 87.63,66.04 87.63,68.58 87,69.22 79.06,69.22 65.41,82.87 IC8.12 65.41,88.9 66.68,90.17 66.68,97.79 76.2,107.32 84.45,107.32 87,109.86 IC10.12 87,112.4 85.09,114.3 78.42,114.3 71.12,121.6 71.12,158.75 65.41,164.47 IC6.12 | JP2.4 39.37,211.45 40.96,209.87 40.96,162.56 23.5,145.1 23.5,103.82 15.88,96.2 15.88,90.17 14.61,88.9 IC2.12
SCK
  Top 0.406: IC7.11 51.43,42.54 52.7,43.81 57.78,43.81 59.05,42.54 IC9.11 | IC3.11 10.79,42.54 11.43,43.18 11.43,52.7 17.15,58.42 17.15,73.34 12.06,78.42 IC2.11
  Bottom 0.406: IC3.11 12.38,42.54 14.61,44.77 14.61,49.21 33.34,67.95 IC5.11 36.2,67.95 40.64,63.5 40.64,46.67 44.77,42.54 IC7.11 50.48,42.54 52.07,44.13 52.07,49.53 53.02,50.48 53.02,73.98 54.61,75.57 54.61,87.63 37.46,104.78 IC4.11 | 84.14,67.95 IC11.11 | 84.14,67.95 65.41,49.21 65.41,44.77 63.18,42.54 IC9.11 | IC6.11 66.99,161.92 70.48,158.43 70.48,121.29 78.11,113.67 83.19,113.67 84.45,112.4 IC10.11 84.45,109.86 82.55,107.95 75.88,107.95 64.14,96.2 64.14,90.17 62.86,88.9 IC8.11 62.86,84.45 78.74,68.58 83.5,68.58 84.14,67.95 | JP2.3 39.37,208.91 40.32,207.96 40.32,162.88 22.86,145.41 22.86,104.14 13.33,94.62 13.33,90.17 12.06,88.9 IC2.11
VCC
  Top 0.406: IC7.10 51.43,45.09 52.7,46.35 57.78,46.35 59.05,45.09 IC9.10 61.59,45.09 62.23,44.45 62.23,36.83 61.59,36.2 59.05,36.2 58.42,35.56 58.42,34.29 59.05,33.66 61.59,33.66 62.23,33.02 62.23,30.48 61.59,29.85 IC9.16 | IC3.10 8.26,45.09 7.62,44.45 7.62,36.83 8.26,36.2 13.33,36.2 | IC5.10 36.2,70.48 36.83,69.85 36.83,62.23 36.2,61.59 33.66,61.59 33.02,60.96 33.02,59.69 33.66,59.05 36.2,59.05 38.73,61.59 | IC2.10 9.53,87 10.16,87.63 20.32,87.63 20.96,87 20.96,84.45 21.59,83.82 24.77,83.82 | IC8.16 75.57,84.45 74.93,83.82 72.39,83.82 71.76,84.45 71.76,87 71.12,87.63 60.96,87.63 60.32,87 IC8.10 | IC4.10 34.92,106.68 43.02,98.58
  Top 1.27: IC2.16 24.77,83.82 24.77,80.01 19.05,74.3 19.05,57.47 13.33,51.75 13.33,36.2 13.33,32.38 10.79,29.85 IC3.16 | IC4.16 50.16,105.73 43.02,98.58 42.86,98.43 42.86,82.87 38.73,78.74 38.73,61.59 38.73,57.78 36.2,55.24 IC5.16 | IC6.16 64.14,179.7 58.42,185.42 58.42,200.02 52.07,206.38 JP2.2 JP2.1
  Bottom 0.406: IC10.10 81.92,109.86 80.65,108.59 75.57,108.59 61.59,94.62 61.59,90.17 60.32,88.9 IC8.10 | 61.59,159.38 IC6.10
  Bottom 1.27: IC3.16 12.7,29.85 14.61,27.94 34.92,27.94 | 34.92,27.94 44.45,27.94 46.35,29.85 IC7.16 50.8,29.85 52.7,27.94 57.15,27.94 59.05,29.85 IC9.16 63.5,29.85 65.41,27.94 69.85,27.94 85.73,43.81 IC11.16 87,55.24 89.54,57.78 89.54,68.26 87.31,70.48 IC11.10 79.38,70.48 74.93,74.93 74.93,83.82 75.57,84.45 IC8.16 75.57,88.27 97.16,109.86 IC10.16 | IC5.16 34.92,27.94 | IC4.16 50.16,104.14 49.53,103.51 49.53,100.97 50.16,100.33 60.32,100.33 68.58,108.59 68.58,148.59 61.59,155.57 61.59,159.38 61.59,173.35 62.86,174.62 IC6.16

### Text on the board
Top: 09.2011 | Mux_Board-v0-1-0 | Øystein Smith | LED-Cube-10x10x10-Red
Bottom: 09.2011 | Øystein Smith | Mux_Board-v0-1-0 | LED-Cube-10x10x10-Red